# Altium project ARES_R30_Power.PrjPCB
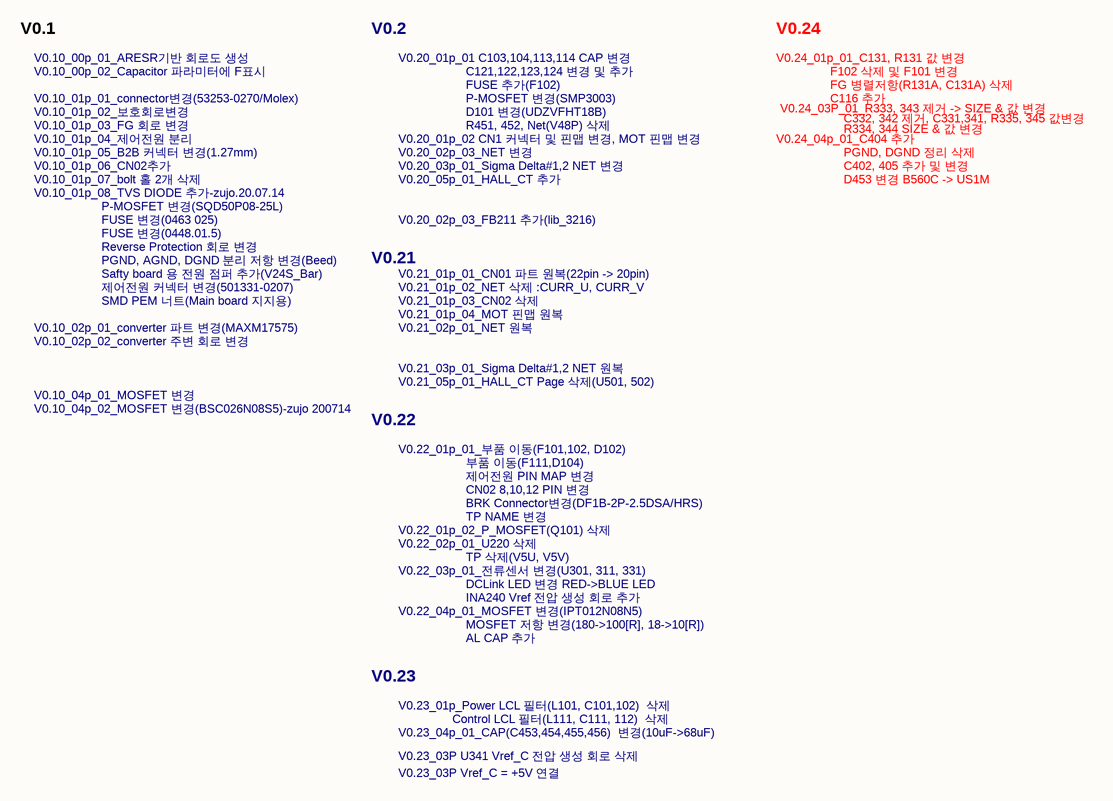
[diagram p0: 00.ChangeLog.SchDoc]
5 sheets, 177 parts. Net scope: global (net labels, ports and power ports of the same name join across sheets).
Board file: ARES_R30_Power.PcbDoc
Sheets:
  00.ChangeLog.SchDoc
  01.Connector.SchDoc
  02.DC-DCConverter.SchDoc
  03.Sensing.SchDoc
  04.MOSFET.SchDoc

## Sheet 00.ChangeLog.SchDoc: ARES_R30_Power
size A4; CompanyName: HIGEN; DrawnBy: 212084; Revision: V0.21; SheetNumber: 0; SheetTotal: 5; DrawingNumber: 임시도면

### Notes on the sheet
- V0.1
- V0.2
- V0.24
- V0.10_00p_01_ARESR기반 회로도 생성
- V0.10_00p_02_Capacitor 파라미터에 F표시
- V0.10_01p_01_connector변경(53253-0270/Molex)
- V0.10_01p_02_보호회로변경
- V0.20_01p_01 C103,104,113,114 CAP 변경
- C121,122,123,124 변경 및 추가
- FUSE 추가(F102)
- D101 변경(UDZVFHT18B)
- P-MOSFET 변경(SMP3003)
- V0.24_01p_01_C131, R131 값 변경
- V0.24_03P_01_R333, 343 제거 -> SIZE & 값 변경
- FG 병렬저항(R131A, C131A) 삭제
- F102 삭제 및 F101 변경
- C116 추가
- V0.10_01p_03_FG 회로 변경
- V0.10_01p_04_제어전원 분리
- V0.10_01p_05_B2B 커넥터 변경(1.27mm)
- V0.10_01p_06_CN02추가
- V0.10_01p_07_bolt 홀 2개 삭제
- V0.20_05p_01_HALL_CT 추가
- V0.20_02p_03_NET 변경
- V0.20_03p_01_Sigma Delta#1,2 NET 변경
- V0.20_01p_02 CN1 커넥터 및 핀맵 변경, MOT 핀맵 변경
- R451, 452, Net(V48P) 삭제
- V0.24_04p_01_C404 추가
- R334, 344 SIZE & 값 변경
- C332, 342 제거, C331,341, R335, 345 값변경
- PGND, DGND 정리 삭제
- C402, 405 추가 및 변경
- D453 변경 B560C -> US1M
- V0.10_01p_08_TVS DIODE 추가-zujo.20.07.14
- Reverse Protection 회로 변경
- FUSE 변경(0463 025)
- FUSE 변경(0448.01.5)
- P-MOSFET 변경(SQD50P08-25L)
- V0.20_02p_03_FB211 추가(lib_3216)
- PGND, AGND, DGND 분리 저항 변경(Beed)
- Safty board 용 전원 점퍼 추가(V24S_Bar)
- 제어전원 커넥터 변경(501331-0207)
- SMD PEM 너트(Main board 지지용)
- V0.21
- V0.21_01p_01_CN01 파트 원복(22pin -> 20pin)
- V0.21_01p_03_CN02 삭제
- V0.21_01p_02_NET 삭제 :CURR_U, CURR_V
- V0.21_01p_04_MOT 핀맵 원복
- V0.10_02p_01_converter 파트 변경(MAXM17575)
- V0.10_02p_02_converter 주변 회로 변경
- V0.21_05p_01_HALL_CT Page 삭제(U501, 502)
- V0.21_03p_01_Sigma Delta#1,2 NET 원복
- V0.21_02p_01_NET 원복
- V0.10_04p_01_MOSFET 변경
- V0.10_04p_02_MOSFET 변경(BSC026N08S5)-zujo 200714
- V0.22
- V0.22_01p_01_부품 이동(F101,102, D102)
- CN02 8,10,12 PIN 변경
- 제어전원 PIN MAP 변경
- 부품 이동(F111,D104)
- BRK Connector변경(DF1B-2P-2.5DSA/HRS)
- TP NAME 변경
- V0.22_02p_01_U220 삭제
- V0.22_03p_01_전류센서 변경(U301, 311, 331)
- V0.22_01p_02_P_MOSFET(Q101) 삭제
- TP 삭제(V5U, V5V)
- DCLink LED 변경 RED->BLUE LED
- V0.22_04p_01_MOSFET 변경(IPT012N08N5)
- INA240 Vref 전압 생성 회로 추가
- MOSFET 저항 변경(180->100[R], 18->10[R])
- AL CAP 추가
- V0.23
- V0.23_01p_Power LCL 필터(L101, C101,102)  삭제
- Control LCL 필터(L111, C111, 112)  삭제
- V0.23_04p_01_CAP(C453,454,455,456)  변경(10uF->68uF)
- V0.23_03P U341 Vref_C 전압 생성 회로 삭제
- V0.23_03P Vref_C = +5V 연결
- -
- DWG.
- UNIT
- DESIGNED
- mm
- CHECKED
- SCALE
- APPROVED
- N/S
- TITLE
- HIGEN
- Related DWG. No.
- SUBJECT
- DWG. No.
- Ver.

## Sheet 01.Connector.SchDoc: ARES_R30_Power
size A4; CompanyName: HIGEN; DrawnBy: 212084; Revision: V0.21; SheetNumber: 1; SheetTotal: 5; DrawingNumber: 임시도면
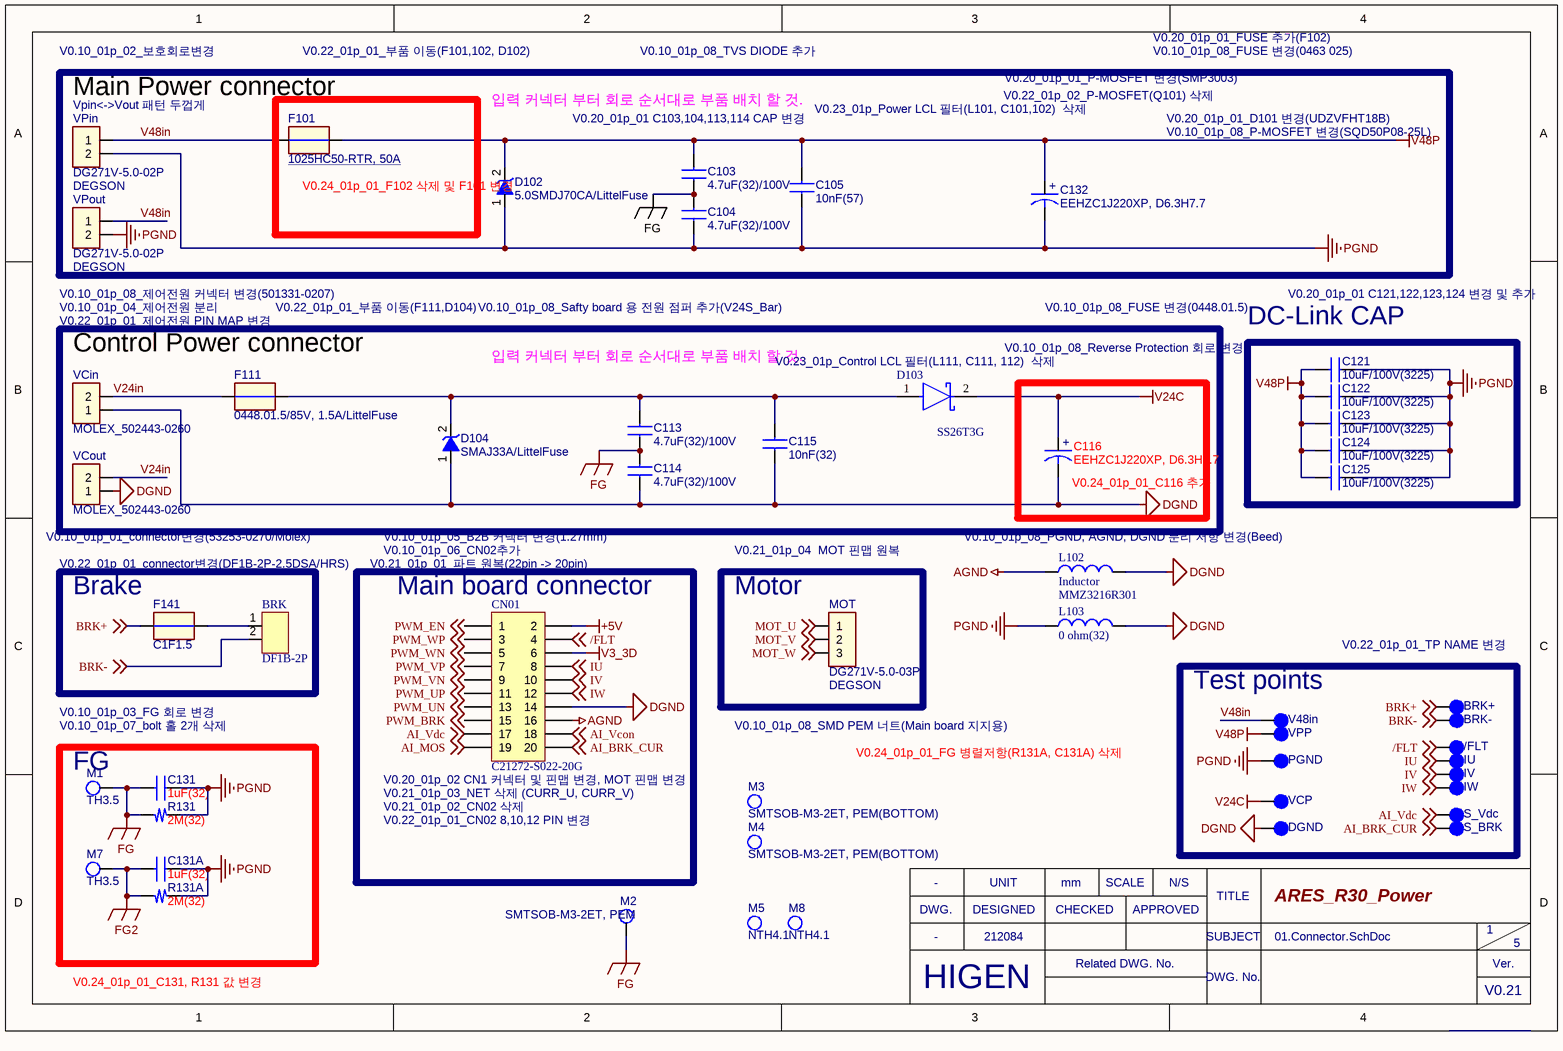
[diagram p1: 01.Connector.SchDoc]

### Parts
/FLT  TP  [TP-SMD]  (value not drawn)
BRK  DF1B-2P  [DF1B-2P-2.5DSA]
BRK+  TP  [TP-SMD]  (value not drawn)
BRK-  TP  [TP-SMD]  (value not drawn)
C103  4.7uF(32)/100V  [C-3216]
C104  4.7uF(32)/100V  [C-3216]
C105  10nF(57)  [C-5750]
C113  4.7uF(32)/100V  [C-3216]
C114  4.7uF(32)/100V  [C-3216]
C115  10nF(32)  [C-3216S]
C116  EEHZC1J220XP, D6.3H7.7  [EC-F80]
C121  10uF/100V(3225)  [C-3225]
C122  10uF/100V(3225)  [C-3225]
C123  10uF/100V(3225)  [C-3225]
C124  10uF/100V(3225)  [C-3225]
C125  10uF/100V(3225)  [C-3225]
C131  1uF(32)  [C-3216S]
C131A  1uF(32)  [C-3216S]
C132  EEHZC1J220XP, D6.3H7.7  [EC-F80]
CN01  C21272-S022-20G  [PH08SMD-D20P_PWR]
D102  5.0SMDJ70CA/LittelFuse  [DO-214AB]
D103  SS26T3G  [DO-214AA]  (value not drawn)
D104  SMAJ33A/LittelFuse  [SMA]
DGND  TP  [TP-SMD]  (value not drawn)
F101  1025HC50-RTR, 50A  [FUSE-SMT_1025HC50-RTR_50A]
F111  0448.01.5/85V, 1.5A/LittelFuse  [0448.005]
F141  C1F1.5  [C-3216]
IU  TP  [TP-SMD]  (value not drawn)
IV  TP  [TP-SMD]  (value not drawn)
IW  TP  [TP-SMD]  (value not drawn)
L102  Inductor  value MMZ3216R301  [L-3216]
L103  0 ohm(32)  [L-3216]
M1  TH3.5  [MH-3.5MM]
M2  SMTSOB-M3-2ET, PEM  [SMTSOB-M3-2]
M3  SMTSOB-M3-2ET, PEM(BOTTOM)  [SMTSOB-M3-2_BOT]
M4  SMTSOB-M3-2ET, PEM(BOTTOM)  [SMTSOB-M3-2_BOT]
M5  NTH4.1  [NTH4.1]
M7  TH3.5  [MH-3.5MM]
M8  NTH4.1  [NTH4.1]
MOT  DG271V-5.0-03P  [DG271V-5.0-03P]
PGND  TP  [TP-SMD]  (value not drawn)
R131  2M(32)  [R-3216S]
R131A  2M(32)  [R-3216S]
S_BRK  TP  [TP-SMD]  (value not drawn)
S_Vdc  TP  [TP-SMD]  (value not drawn)
V48in  TP  [TP-SMD]  (value not drawn)
VCin  MOLEX_502443-0260  [MOLEX_502443-0260]
VCout  MOLEX_502443-0260  [MOLEX_502443-0260]
VCP  TP  [TP-SMD]  (value not drawn)
VPin  DG271V-5.0-02P  [DG271V-5.0-02P]
VPout  DG271V-5.0-02P  [DG271V-5.0-02P]
VPP  TP  [TP-SMD]  (value not drawn)

### Blocks framed on the sheet
Main Power connector: C103-C105 C132 D102 VPin VPout
V0.24_01p_01_F102 삭제 및 F101 변경: F101
Control Power connector: C113-C115 D103 D104 F111 VCin VCout
V0.24_01p_01_C116 추가: C116
Brake: BRK F141
Main board connector: CN01
Motor: MOT
Test points: /FLT BRK+ BRK- DGND IU IV IW PGND S_BRK S_Vdc V48in VCP VPP
FG: C131 C131A M1 M7 R131 R131A

### Nets
+5V: CN01.2
AGND: CN01.16 L102.1
DGND: C114.1 C115.1 C116.2 CN01.14 D104.1(A) DGND.1 L102.2 L103.2 VCin.1 VCout.1
FG: C103.1 C104.2 C113.1 C114.2 C131.1 M1.1(TP) M2.1(TP) R131.1(P1)
FG2: C131A.1 M7.1(TP) R131A.1(P1)
PGND: C104.1 C105.1 C121.2 C122.2 C123.2 C124.2 C125.2 C131.2 C131A.2 C132.2 D102.1(A) L103.1 PGND.1 R131.2(P2) R131A.2(P2) VPin.2 VPout.2
V3_3D: CN01.6
V24C: C116.1 D103.2(C) VCP.1
V48P: C103.2 C105.2 C121.1 C122.1 C123.1 C124.1 C125.1 C132.1 D102.2(K) F101.2 VPP.1
/FLT: /FLT.1 CN01.4 ; off-sheet /FLT
AI_BRK_CUR: CN01.20 S_BRK.1 ; off-sheet AI_BRK_CUR
AI_MOS: CN01.19 ; off-sheet AI_MOS
AI_Vcon: CN01.18 ; off-sheet AI_Vcon
AI_Vdc: CN01.17 S_Vdc.1 ; off-sheet AI_Vdc
BRK+: BRK+.1 F141.2 ; off-sheet BRK+
BRK-: BRK.2 BRK-.1 ; off-sheet BRK-
IU: CN01.8 IU.1 ; off-sheet IU
IV: CN01.10 IV.1 ; off-sheet IV
IW: CN01.12 IW.1 ; off-sheet IW
MOT_U: MOT.1 ; off-sheet MOT_U
MOT_V: MOT.2 ; off-sheet MOT_V
MOT_W: MOT.3 ; off-sheet MOT_W
PWM_BRK: CN01.15 ; off-sheet PWM_BRK
PWM_EN: CN01.1 ; off-sheet PWM_EN
PWM_UN: CN01.13 ; off-sheet PWM_UN
PWM_UP: CN01.11 ; off-sheet PWM_UP
PWM_VN: CN01.9 ; off-sheet PWM_VN
PWM_VP: CN01.7 ; off-sheet PWM_VP
PWM_WN: CN01.5 ; off-sheet PWM_WN
PWM_WP: CN01.3 ; off-sheet PWM_WP
V24in: F111.1 VCin.2 VCout.2
V48in: F101.1 V48in.1 VPin.1 VPout.1
NetBRK_1: BRK.1 F141.1
NetC113_2: C113.2 C115.2 D103.1(A) D104.2(K) F111.2

Not connected (* = marked no-connect by the designer): M3 1(TP); M4 1(TP); M5 1(TP); M8 1(TP)

### Notes on the sheet
- V0.20_01p_01_FUSE 추가(F102)
- V0.10_01p_02_보호회로변경
- (near VPin) Vpin<->Vout 패턴 두껍게
- V0.22_01p_01_부품 이동(F101,102, D102)
- 입력 커넥터 부터 회로 순서대로 부품 배치 할 것.
- V0.10_01p_08_TVS DIODE 추가
- V0.23_01p_Power LCL 필터(L101, C101,102)  삭제
- V0.22_01p_02_P-MOSFET(Q101) 삭제
- V0.20_01p_01_P-MOSFET 변경(SMP3003)
- V0.10_01p_08_FUSE 변경(0463 025)
- V0.20_01p_01 C103,104,113,114 CAP 변경
- V0.10_01p_08_P-MOSFET 변경(SQD50P08-25L)
- V0.20_01p_01_D101 변경(UDZVFHT18B)
- DEGSON
- V0.10_01p_04_제어전원 분리
- V0.10_01p_08_제어전원 커넥터 변경(501331-0207)
- (near VPout) DEGSON
- V0.22_01p_01_부품 이동(F111,D104)
- V0.10_01p_08_Safty board 용 전원 점퍼 추가(V24S_Bar)
- V0.10_01p_08_FUSE 변경(0448.01.5)
- (near C121) DC-Link CAP
- V0.20_01p_01 C121,122,123,124 변경 및 추가
- V0.22_01p_01_제어전원 PIN MAP 변경
- (near D103) V0.23_01p_Control LCL 필터(L111, C111, 112)  삭제
- V0.10_01p_08_Reverse Protection 회로 변경
- (near VCout) V0.10_01p_01_connector변경(53253-0270/Molex)
- V0.22_01p_01_connector변경(DF1B-2P-2.5DSA/HRS)
- V0.21_01p_01_파트 원복(22pin -> 20pin)
- V0.10_01p_05_B2B 커넥터 변경(1.27mm)
- V0.10_01p_06_CN02추가
- V0.21_01p_04  MOT 핀맵 원복
- (near L102) V0.10_01p_08_PGND, AGND, DGND 분리 저항 변경(Beed)
- V0.22_01p_01_TP NAME 변경
- V0.10_01p_03_FG 회로 변경
- (near MOT) DEGSON
- V0.10_01p_07_bolt 홀 2개 삭제
- (near CN01) V0.20_01p_02 CN1 커넥터 및 핀맵 변경, MOT 핀맵 변경
- V0.10_01p_08_SMD PEM 너트(Main board 지지용)
- V0.24_01p_01_FG 병렬저항(R131A, C131A) 삭제
- (near CN01) V0.21_01p_03_NET 삭제 (CURR_U, CURR_V)
- V0.21_01p_02_CN02 삭제
- V0.22_01p_01_CN02 8,10,12 PIN 변경
- V0.24_01p_01_C131, R131 값 변경
- -
- DWG.
- UNIT
- DESIGNED
- mm
- CHECKED
- SCALE
- APPROVED
- N/S
- TITLE
- HIGEN
- Related DWG. No.
- SUBJECT
- DWG. No.
- Ver.
- (in symbol CAP_Pol) +

### Library data of the parts
/FLT BRK+ BRK- DGND IU IV IW PGND S_BRK S_Vdc V48in VCP VPP = 2H_TestPointThroughHole
BRK = Component_1
C103-C105 C113-C115 C121-C125 C131 C131A = CAP_NP
C116 C132 = CAP_Pol
CN01 = Header 10X2: Header, 10-Pin, Dual row; LatestRevisionDate: 17-Jul-2002; LatestRevisionNote: Re-released for DXP Platform.; Publisher: Altium Limited
D102 D104 = Diode_TVS
D103 = SS26T3G: DIODE SCHOTTKY 60V 2A SMB; 3DS Part Number: 417-00001; Manufacturer: ON Semi; Capacitance: SKIP; Library Path1: parts/Diode_ON_Semi_SS26T3G_eec.SchLib; Max Junction Temp: +150°C; Max Surge Forward Current: 40A; Peak Reverse Current: 0.2mA; Standoff Height: 0.05mm; Value: SKIP; Verification Version: 0.0.0.1; Part Number: SS26T3G; Datasheet Path: datasheets/Diode_ON_Semi_SS26T3G_eec.pdf; ComponentLink1Description: Upverter; ComponentLink1URL: https://upverter.com/upn/revision/e2f486cca74213e5/; ComponentLink2Description: Datasheet; ComponentLink2URL: http://www.onsemi.cn/PowerSolutions/document/SS26-D.PDF; Datasheet Path1: datasheets/Diode_ON_Semi_SS26T3G_eec.pdf; Dc Blocking Voltage: 60V; Digikey Description: DIODE SCHOTTKY 60V 2A SMB; Digikey Part Number: SS26T3GOSCT-ND; Footprint Url: http://www.onsemi.com/pub/Collateral/403A-03.PDF; Forward Current: 2A; Height: 2.47mm; Inductance: SKIP; Lead Free: yes; Library Ref1: SS26T3G; Max Repetitive Reverse Voltage: 60V; Mouser Description: SMB Power Surface Mount Package employing the Schottky Barrier principle in a metal-to-silicon power rectifier.; Mouser Part Number: 863-SS26T3G; Package: 403A-03; Price: 0.196415605484; Resistance: SKIP; RoHS: TRUE; Supplier 1: Digi-Key; Supplier 2: Mouser; Supplier Part Number 1: SS26T3GOSCT-ND; Supplier Part Number 2: 863-SS26T3G; Temperature: -55°C to +150°C; Temperature Range High: +150°C; Temperature Range Low: -55°C; Voltage: SKIP; Working Reverse Voltage: 60V; helpURL: https://upverter.com/upn/revision/e2f486cca74213e5/
F101 F111 F141 = Fuse
L102 L103 = Inductor: Code_IEC: 1005; Published: 8-Jun-2000; LatestRevisionDate: 29-May-2009; LatestRevisionNote: IPC-7351 Footprint Added.; PackageReference: 0402-A; Publisher: Altium Limited; PackageDescription: Chip Inductor; Code_JEITA: 0402
M1-M5 M7 M8 = ThroughHole
MOT = Connector_1x3
R131 R131A = Res
VCin VCout VPin VPout = Connector_1x2

## Sheet 02.DC-DCConverter.SchDoc: ARES_R30_Power
size A4; CompanyName: HIGEN; DrawnBy: 212084; Revision: V0.21; SheetNumber: 2; SheetTotal: 5; DrawingNumber: 임시도면
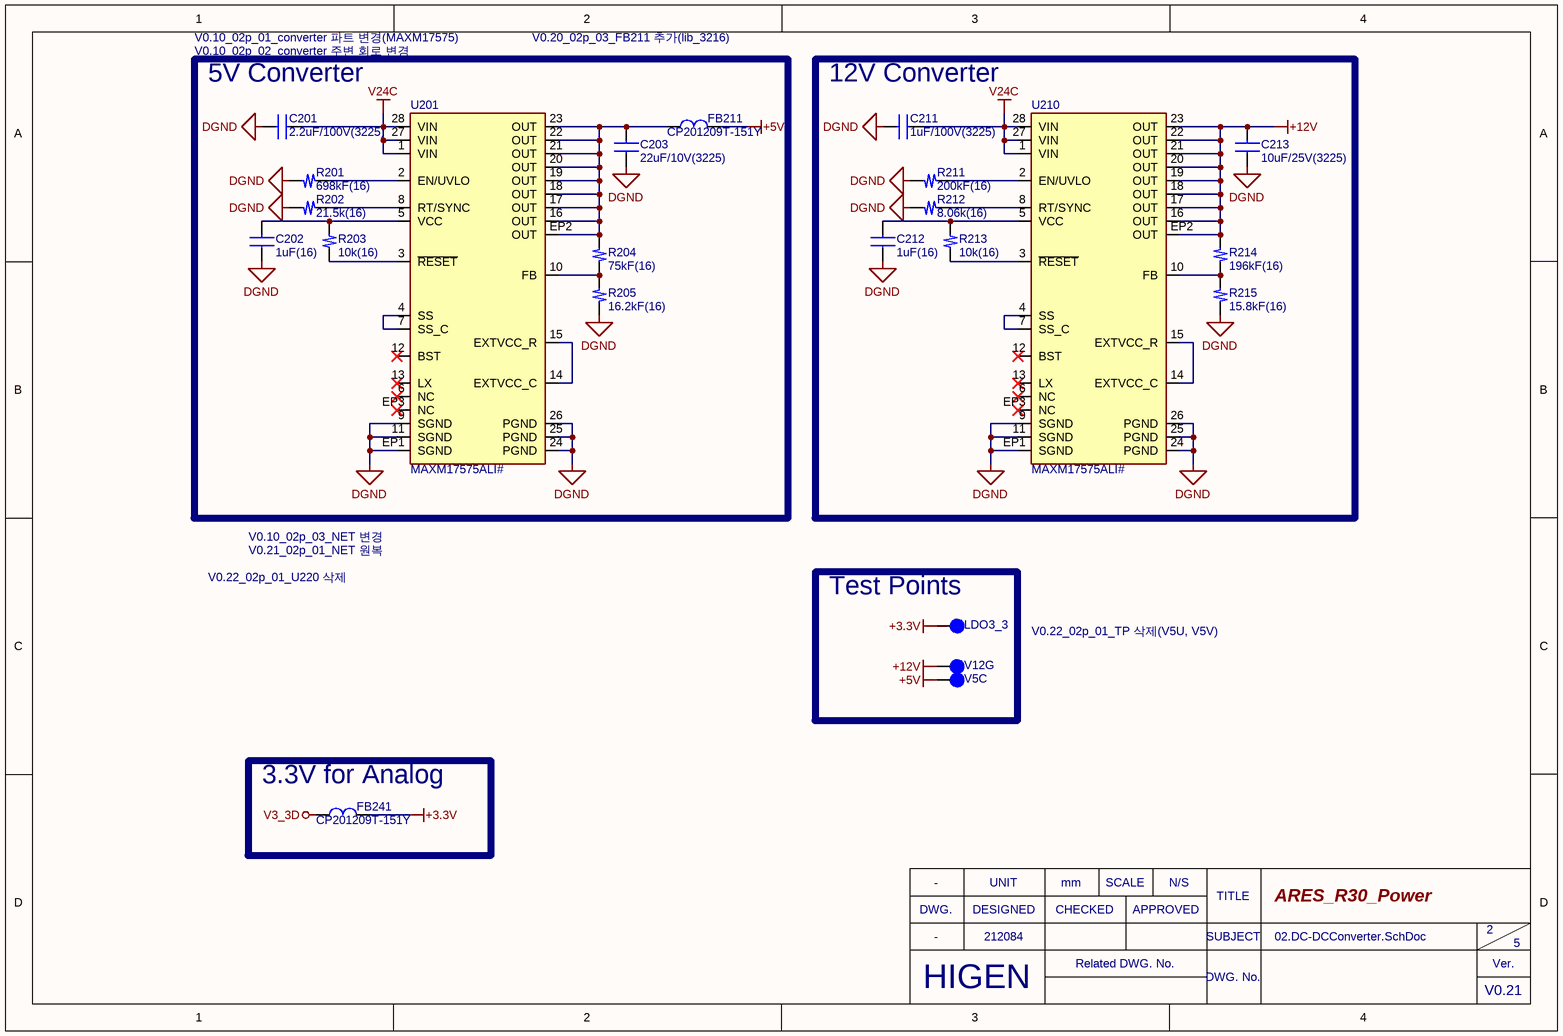
[diagram p2: 02.DC-DCConverter.SchDoc]

### Parts
C201  2.2uF/100V(3225)  [C-3225]
C202  1uF(16)  [C-1608S]
C203  22uF/10V(3225)  [C-3225]
C211  1uF/100V(3225)  [C-3225]
C212  1uF(16)  [C-1608S]
C213  10uF/25V(3225)  [C-3225]
FB211  CP201209T-151Y  [L-2012]
FB241  CP201209T-151Y  [L-2012]
LDO3_3  TP  [TP-SMD]  (value not drawn)
R201  698kF(16)  [R-1608S]
R202  21.5k(16)  [R-1608S]
R203  10k(16)  [R-1608S]
R204  75kF(16)  [R-1608S]
R205  16.2kF(16)  [R-1608S]
R211  200kF(16)  [R-1608S]
R212  8.06k(16)  [R-1608S]
R213  10k(16)  [R-1608S]
R214  196kF(16)  [R-1608S]
R215  15.8kF(16)  [R-1608S]
U201  MAXM17575ALI#  [LGA28-0.5MM-10X6.5_3.45]
U210  MAXM17575ALI#  [LGA28-0.5MM-10X6.5_3.45]
V5C  TP  [TP-SMD]  (value not drawn)
V12G  TP  [TP-SMD]  (value not drawn)

### Blocks framed on the sheet
5V Converter: C201-C203 FB211 R201-R205 U201
12V Converter: C211-C213 R211-R215 U210
Test Points: LDO3_3 V5C V12G
3.3V for Analog: FB241

### Nets
+3.3V: FB241.2 LDO3_3.1
+5V: FB211.2 V5C.1
+12V: C213.2 R214.1(P1) U210.16(OUT) U210.17(OUT) U210.18(OUT) U210.19(OUT) U210.20(OUT) U210.21(OUT) U210.22(OUT) U210.23(OUT) U210.EP2(OUT) V12G.1
DGND: C201.1 C202.2 C203.1 C211.1 C212.2 C213.1 R201.2(P2) R202.2(P2) R205.2(P2) R211.2(P2) R212.2(P2) R215.2(P2) U201.9(SGND) U201.11(SGND) U201.24(PGND) U201.25(PGND) U201.26(PGND) U201.EP1(SGND) U210.9(SGND) U210.11(SGND) U210.24(PGND) U210.25(PGND) U210.26(PGND) U210.EP1(SGND)
V3_3D: FB241.1
V24C: C201.2 C211.2 U201.1(VIN) U201.27(VIN) U201.28(VIN) U210.1(VIN) U210.27(VIN) U210.28(VIN)
NetC202_1: C202.1 R203.1(P1) U201.5(VCC)
NetC203_2: C203.2 FB211.1 R204.1(P1) U201.16(OUT) U201.17(OUT) U201.18(OUT) U201.19(OUT) U201.20(OUT) U201.21(OUT) U201.22(OUT) U201.23(OUT) U201.EP2(OUT)
NetC212_1: C212.1 R213.1(P1) U210.5(VCC)
NetR201_1: R201.1(P1) U201.2(EN/UVLO)
NetR202_1: R202.1(P1) U201.8(RT/SYNC)
NetR203_2: R203.2(P2) U201.3(~{RESET})
NetR204_2: R204.2(P2) R205.1(P1) U201.10(FB)
NetR211_1: R211.1(P1) U210.2(EN/UVLO)
NetR212_1: R212.1(P1) U210.8(RT/SYNC)
NetR213_2: R213.2(P2) U210.3(~{RESET})
NetR214_2: R214.2(P2) R215.1(P1) U210.10(FB)
NetU201_4: U201.4(SS) U201.7(SS_C)
NetU201_14: U201.14(EXTVCC_C) U201.15(EXTVCC_R)
NetU210_4: U210.4(SS) U210.7(SS_C)
NetU210_14: U210.14(EXTVCC_C) U210.15(EXTVCC_R)

Not connected (* = marked no-connect by the designer): U201 6(NC)* 12(BST)* 13(LX)* EP3(NC)*; U210 6(NC)* 12(BST)* 13(LX)* EP3(NC)*

### Notes on the sheet
- V0.10_02p_01_converter 파트 변경(MAXM17575)
- V0.20_02p_03_FB211 추가(lib_3216)
- V0.10_02p_02_converter 주변 회로 변경
- V0.22_02p_01_U220 삭제
- V0.10_02p_03_NET 변경
- V0.21_02p_01_NET 원복
- V0.22_02p_01_TP 삭제(V5U, V5V)
- -
- DWG.
- UNIT
- DESIGNED
- mm
- CHECKED
- SCALE
- APPROVED
- N/S
- TITLE
- HIGEN
- Related DWG. No.
- SUBJECT
- DWG. No.
- Ver.

### Library data of the parts
C201-C203 C211-C213 = CAP_NP
FB211 FB241 = FBead
LDO3_3 V5C V12G = 2H_TestPointThroughHole: Mfr: Keystone Electronics; MfrNum: 5002; TIIntPartnumber: 2H0026; DescriptiveText: Testpoint Miniature Through Hole; Vendor: Digikey; Cost100: 0.163; Cost10K: 0.10; PartName: TestPointThroughHole
R201-R205 R211-R215 = Res

## Sheet 03.Sensing.SchDoc: ARES_R30_Power
size A4; CompanyName: HIGEN; DrawnBy: 212084; Revision: V0.21; SheetNumber: 3; SheetTotal: 5; DrawingNumber: 임시도면
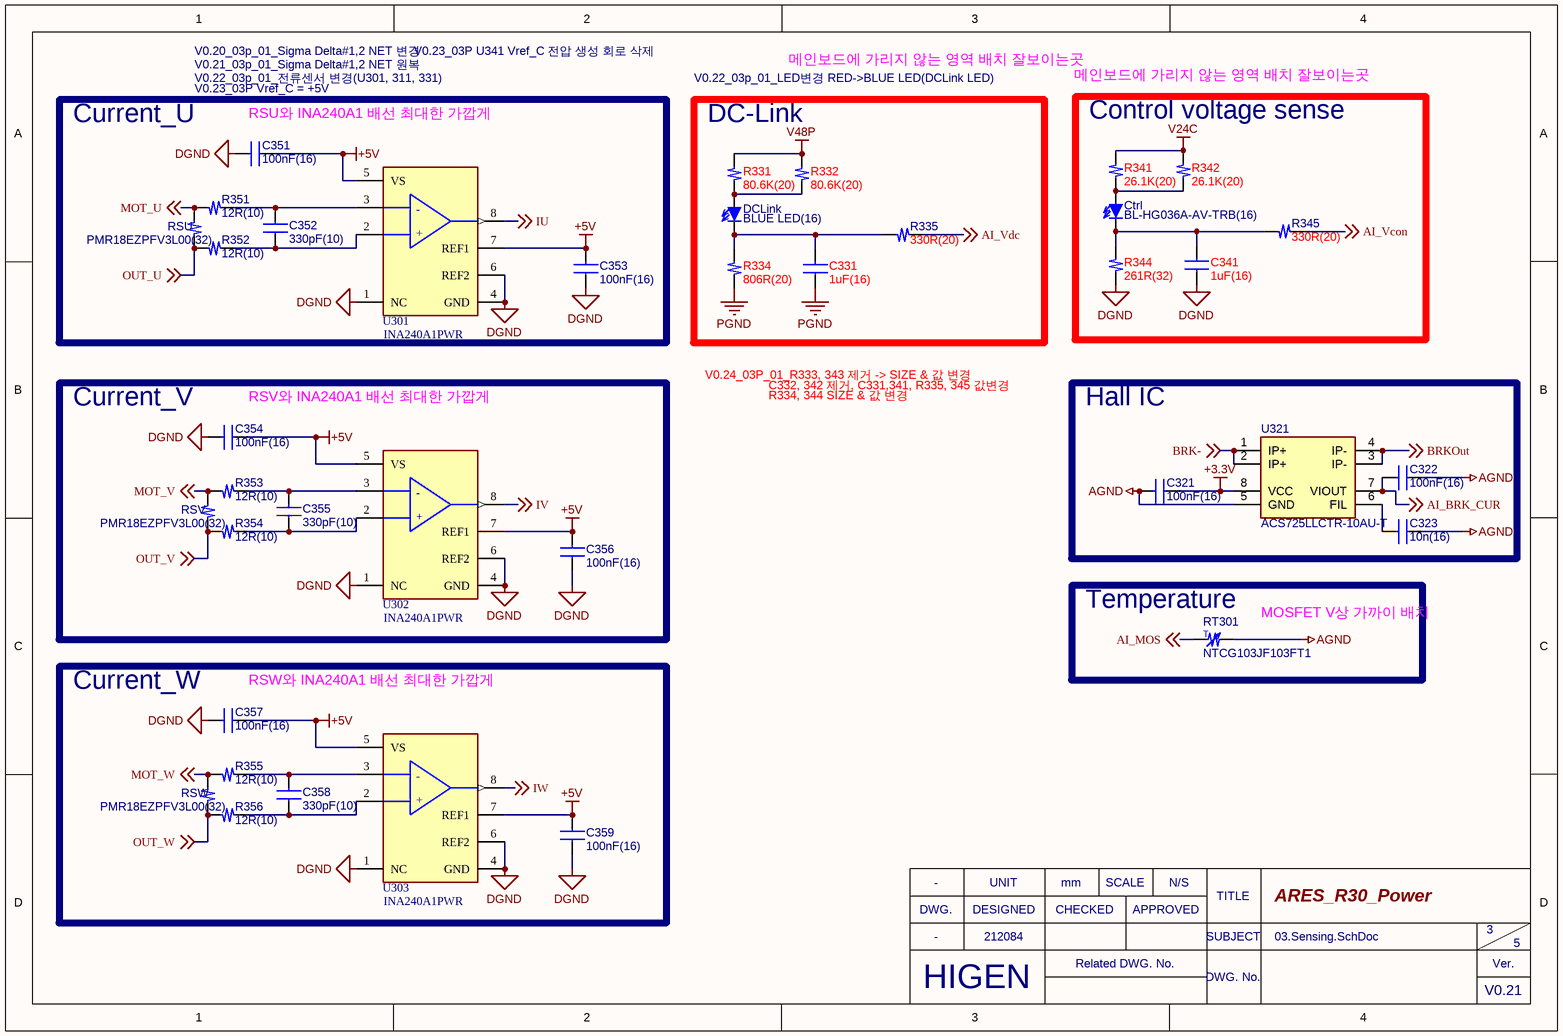
[diagram p3: 03.Sensing.SchDoc]

### Parts
C321  100nF(16)  [C-1608S]
C322  100nF(16)  [C-1608S]
C323  10n(16)  [C-1608S]
C331  1uF(16)  [C-1608S]
C341  1uF(16)  [C-1608S]
C351  100nF(16)  [C-1608S]
C352  330pF(10)  [C-1005S]
C353  100nF(16)  [C-1608]
C354  100nF(16)  [C-1608S]
C355  330pF(10)  [C-1005S]
C356  100nF(16)  [C-1608]
C357  100nF(16)  [C-1608S]
C358  330pF(10)  [C-1005S]
C359  100nF(16)  [C-1608]
Ctrl  BL-HG036A-AV-TRB(16)  [LED-1608-G]
DCLink  BLUE LED(16)  [LED-1608-B]
R331  80.6K(20)  [RES-2012]
R332  80.6K(20)  [RES-2012]
R334  806R(20)  [RES-2012]
R335  330R(20)  [RES-2012]
R341  26.1K(20)  [RES-2012]
R342  26.1K(20)  [RES-2012]
R344  261R(32)  [R-3216S]
R345  330R(20)  [RES-2012]
R351  12R(10)  [R-1005S]
R352  12R(10)  [R-1005S]
R353  12R(10)  [R-1005S]
R354  12R(10)  [R-1005S]
R355  12R(10)  [R-1005S]
R356  12R(10)  [R-1005S]
RSU  PMR18EZPFV3L00(32)  [R-5025]
RSV  PMR18EZPFV3L00(32)  [R-5025]
RSW  PMR18EZPFV3L00(32)  [R-5025]
RT301  NTCG103JF103FT1  [L-1005]
U301  INA240A1PWR  [TSSOP-8]
U302  INA240A1PWR  [TSSOP-8]
U303  INA240A1PWR  [TSSOP-8]
U321  ACS725LLCTR-10AU-T  [SO-8]

### Blocks framed on the sheet
Current_U: C351-C353 R351 R352 RSU U301
DC-Link: C331 DCLink R331 R332 R334 R335
Control voltage sense: C341 Ctrl R341 R342 R344 R345
Current_V: C354-C356 R353 R354 RSV U302
Hall IC: C321-C323 U321
Temperature: RT301
Current_W: C357-C359 R355 R356 RSW U303

### Nets
+3.3V: C321.2 U321.8(VCC)
+5V: C351.1 C353.1 C354.1 C356.1 C357.1 C359.1 U301.5(VS) U301.7(REF1) U302.5(VS) U302.7(REF1) U303.5(VS) U303.7(REF1)
AGND: C321.1 C322.2 C323.2 RT301.1 U321.5(GND)
DGND: C341.2 C351.2 C353.2 C354.2 C356.2 C357.2 C359.2 R344.2(P2) U301.1(NC) U301.4(GND) U301.6(REF2) U302.1(NC) U302.4(GND) U302.6(REF2) U303.1(NC) U303.4(GND) U303.6(REF2)
PGND: C331.2 R334.2(P2)
V24C: R341.1(P1) R342.1(P1)
V48P: R331.1(P1) R332.1(P1)
AI_BRK_CUR: C322.1 U321.7(VIOUT) ; off-sheet AI_BRK_CUR
AI_MOS: RT301.2 ; off-sheet AI_MOS
AI_Vcon: R345.2(P2) ; off-sheet AI_Vcon
AI_Vdc: R335.2(P2) ; off-sheet AI_Vdc
BRK-: U321.1(IP+) U321.2(IP+) ; off-sheet BRK-
BRKOut: U321.3(IP-) U321.4(IP-) ; off-sheet BRKOut
IU: U301.8(OUT) ; off-sheet IU
IV: U302.8(OUT) ; off-sheet IV
IW: U303.8(OUT) ; off-sheet IW
MOT_U: R351.1(P1) RSU.1(P1) ; off-sheet MOT_U
MOT_V: R353.1(P1) RSV.1(P1) ; off-sheet MOT_V
MOT_W: R355.1(P1) RSW.1(P1) ; off-sheet MOT_W
OUT_U: R352.1(P1) RSU.2(P2) ; off-sheet OUT_U  [project net PH_U]
OUT_V: R354.1(P1) RSV.2(P2) ; off-sheet OUT_V  [project net PH_V]
OUT_W: R356.1(P1) RSW.2(P2) ; off-sheet OUT_W  [project net PH_W]
NetC323_1: C323.1 U321.6(FIL)
NetC331_1: C331.1 DCLink.2(Cathode) R334.1(P1) R335.1(P1)
NetC341_1: C341.1 Ctrl.2(Cathode) R344.1(P1) R345.1(P1)
NetC352_1: C352.1 R352.2(P2) U301.2(IN+)
NetC352_2: C352.2 R351.2(P2) U301.3(IN-)
NetC355_1: C355.1 R354.2(P2) U302.2(IN+)
NetC355_2: C355.2 R353.2(P2) U302.3(IN-)
NetC358_1: C358.1 R356.2(P2) U303.2(IN+)
NetC358_2: C358.2 R355.2(P2) U303.3(IN-)
NetCtrl_1: Ctrl.1(Anode) R341.2(P2) R342.2(P2)
NetDCLink_1: DCLink.1(Anode) R331.2(P2) R332.2(P2)

### Notes on the sheet
- V0.20_03p_01_Sigma Delta#1,2 NET 변경
- V0.21_03p_01_Sigma Delta#1,2 NET 원복
- V0.22_03p_01_전류센서 변경(U301, 311, 331)
- V0.23_03P Vref_C = +5V
- (near C351) RSU와 INA240A1 배선 최대한 가깝게
- V0.23_03P U341 Vref_C 전압 생성 회로 삭제
- V0.22_03p_01_LED변경 RED->BLUE LED(DCLink LED)
- 메인보드에 가리지 않는 영역 배치 잘보이는곳
- V0.24_03P_01_R333, 343 제거 -> SIZE & 값 변경
- (near C354) RSV와 INA240A1 배선 최대한 가깝게
- R334, 344 SIZE & 값 변경
- C332, 342 제거, C331,341, R335, 345 값변경
- (near RT301) MOSFET V상 가까이 배치
- (near C357) RSW와 INA240A1 배선 최대한 가깝게
- -
- DWG.
- UNIT
- DESIGNED
- mm
- CHECKED
- SCALE
- APPROVED
- N/S
- TITLE
- HIGEN
- Related DWG. No.
- SUBJECT
- DWG. No.
- Ver.
- (in symbol INA240A1PWR) -; +
- (in symbol Res_Thermal) T

### Library data of the parts
C321-C323 C331 C341 C351-C359 = CAP_NP
Ctrl DCLink = LED
R331 R332 R334 R335 R341 R342 R344 R345 R351-R356 RSU RSV RSW = Res
RT301 = Res_Thermal
U301-U303 = INA240A1PWR: IC CURR SENSE 1 CIRCUIT 8TSSOP; Manufacturer: Texas Instruments; Bandwidth: 400kHz; Input Bias Current: 90uA; Input Offset Voltage: 0.005mV; Max Junction Temp: +150°C; Max Supply Voltage: 5.5V; Min Supply Voltage: 2.7V; Nominal Supply Current: 1.8mA; Number Of Channels: 1; Standoff Height: 0.05mm; Verification Version: 0.0.0.3; Voltage Gain: 0.02V/mV; Datasheet Path: datasheets/IC_Texas_Instruments_INA240A1PWR_eec.pdf; Ambient Temperature Range High: +125°C; Ambient Temperature Range Low: -40°C; Automotive: No; ComponentLink1Description: Upverter; ComponentLink1URL: https://upverter.com/part/id/d93607e109c824dd/; ComponentLink2Description: Datasheet; ComponentLink2URL: http://www.ti.com/lit/ds/symlink/ina240.pdf; Digikey Description: IC CURR SENSE 1 CIRCUIT 8TSSOP; Digikey Part Number: 296-45088-1-ND; Height: 1.2mm; Ipc Land Pattern Name: SOP65P300X120-8; Lead Free: Yes; Mouser Part Number: 595-INA240A1PWR; Package: PW0008A; Part Number: INA240A1PWR; RoHS: TRUE; Supplier 1: Digi-Key; Supplier 2: Mouser; Supplier Part Number 1: 296-45088-1-ND; Supplier Part Number 2: 595-INA240A1PWR; Temperature: -40°C to +125°C; Temperature Range High: +125°C; Temperature Range Low: -40°C; helpURL: https://upverter.com/part/id/d93607e109c824dd/
U321 = ACS725LLCTR

## Sheet 04.MOSFET.SchDoc: ARES_R30_Power
size A4; CompanyName: HIGEN; DrawnBy: 212084; Revision: V0.21; SheetNumber: 4; SheetTotal: 5; DrawingNumber: 임시도면
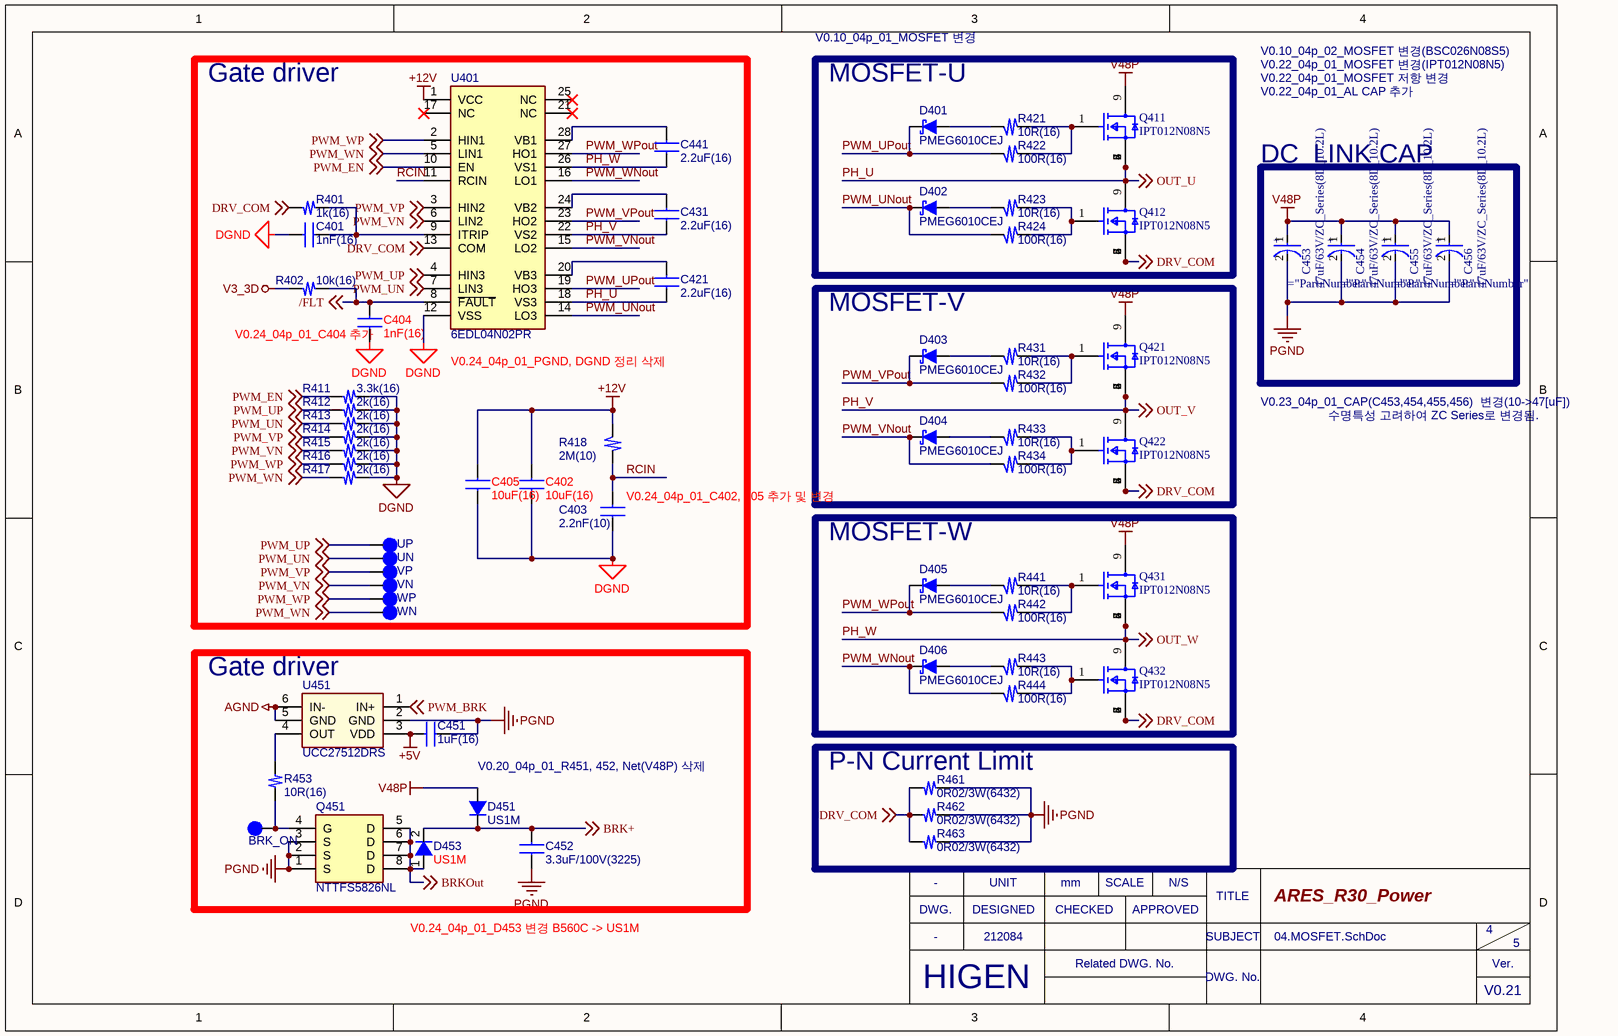
[diagram p4: 04.MOSFET.SchDoc]

### Parts
BRK_ON  TP  [TP-SMD]  (value not drawn)
C401  1nF(16)  [C-1608S]
C402  10uF(16)  [C-1608S]
C403  2.2nF(10)  [C-1005S]
C404  1nF(16)  [C-1608S]
C405  10uF(16)  [C-1608S]
C421  2.2uF(16)  [C-1608S]
C431  2.2uF(16)  [C-1608S]
C441  2.2uF(16)  [C-1608S]
C451  1uF(16)  [C-1608S]
C452  3.3uF/100V(3225)  [C-3225]
C453  47uF/63V/ZC_Series(8D_10.2L)  [EC-H10]
C454  47uF/63V/ZC_Series(8D_10.2L)  [EC-H10]
C455  47uF/63V/ZC_Series(8D_10.2L)  [EC-H10]
C456  47uF/63V/ZC_Series(8D_10.2L)  [EC-H10]
D401  PMEG6010CEJ  [SOD-323]
D402  PMEG6010CEJ  [SOD-323]
D403  PMEG6010CEJ  [SOD-323]
D404  PMEG6010CEJ  [SOD-323]
D405  PMEG6010CEJ  [SOD-323]
D406  PMEG6010CEJ  [SOD-323]
D451  US1M  [SMA]
D453  US1M  [SMA]
Q411  IPT012N08N5  [PG-HSOF-8-1]
Q412  IPT012N08N5  [PG-HSOF-8-1]
Q421  IPT012N08N5  [PG-HSOF-8-1]
Q422  IPT012N08N5  [PG-HSOF-8-1]
Q431  IPT012N08N5  [PG-HSOF-8-1]
Q432  IPT012N08N5  [PG-HSOF-8-1]
Q451  NTTFS5826NL  [WDFN-8]
R401  1k(16)  [R-1608S]
R402  10k(16)  [R-1608S]
R411  3.3k(16)  [R-1608S]
R412  2k(16)  [R-1608S]
R413  2k(16)  [R-1608S]
R414  2k(16)  [R-1608S]
R415  2k(16)  [R-1608S]
R416  2k(16)  [R-1608S]
R417  2k(16)  [R-1608S]
R418  2M(10)  [RES-1005S]
R421  10R(16)  [R-1608S]
R422  100R(16)  [R-1608S]
R423  10R(16)  [R-1608S]
R424  100R(16)  [R-1608S]
R431  10R(16)  [R-1608S]
R432  100R(16)  [R-1608S]
R433  10R(16)  [R-1608S]
R434  100R(16)  [R-1608S]
R441  10R(16)  [R-1608S]
R442  100R(16)  [R-1608S]
R443  10R(16)  [R-1608S]
R444  100R(16)  [R-1608S]
R453  10R(16)  [R-1608S]
R461  0R02/3W(6432)  [R-6432]
R462  0R02/3W(6432)  [R-6432]
R463  0R02/3W(6432)  [R-6432]
U401  6EDL04N02PR  [TSSOP-28]
U451  UCC27512DRS  [WSON-6]
UN  TP  [TP-SMD]  (value not drawn)
UP  TP  [TP-SMD]  (value not drawn)
VN  TP  [TP-SMD]  (value not drawn)
VP  TP  [TP-SMD]  (value not drawn)
WN  TP  [TP-SMD]  (value not drawn)
WP  TP  [TP-SMD]  (value not drawn)

### Blocks framed on the sheet
Gate driver: C401-C405 C421 C431 C441 R401 R402 R411-R418 U401 UN UP VN VP WN WP
MOSFET-U: D401 D402 Q411 Q412 R421-R424
DC_LINK CAP: C453-C456
MOSFET-V: D403 D404 Q421 Q422 R431-R434
MOSFET-W: D405 D406 Q431 Q432 R441-R444
Gate driver: BRK_ON C451 C452 D451 D453 Q451 R453 U451
P-N Current Limit: R461-R463

### Nets
+5V: C451.1 U451.3(VDD)
+12V: C402.1 C405.1 R418.2 U401.1(VCC)
AGND: U451.5(GND) U451.6(IN-)
DGND: C401.1 C402.2 C403.1 C404.1 C405.2 R411.2(P2) R412.1(P1) R413.1(P1) R414.1(P1) R415.1(P1) R416.2(P2) R417.2(P2) U401.12(VSS)
PGND: C451.2 C452.1 C453.2(A) C454.2(A) C455.2(A) C456.2(A) Q451.1(S) Q451.2(S) Q451.3(S) R461.1(P1) R462.1(P1) R463.1(P1) U451.2(GND)
V3_3D: R402.1(P1)
V48P: C453.1(C) C454.1(C) C455.1(C) C456.1(C) D451.1(A) Q411.9(Drain) Q421.9(Drain) Q431.9(Drain)
/FLT: C404.2 R402.2(P2) U401.8(~{FAULT}) ; off-sheet /FLT
BRK+: C452.2 D451.2(K) D453.2(K) ; off-sheet BRK+
BRKOut: D453.1(A) Q451.5(D) Q451.6(D) Q451.7(D) Q451.8(D) ; off-sheet BRKOut
DRV_COM: Q412.2(Source) Q412.3(Source) Q412.4(Source) Q412.5(Source) Q412.6(Source) Q412.7(Source) Q412.8(Source) Q422.2(Source) Q422.3(Source) Q422.4(Source) Q422.5(Source) Q422.6(Source) Q422.7(Source) Q422.8(Source) Q432.2(Source) Q432.3(Source) Q432.4(Source) Q432.5(Source) Q432.6(Source) Q432.7(Source) Q432.8(Source) R401.1(P1) R461.2(P2) R462.2(P2) R463.2(P2) U401.13(COM) ; off-sheet DRV_COM
PH_U: C421.2 Q411.2(Source) Q411.3(Source) Q411.4(Source) Q411.5(Source) Q411.6(Source) Q411.7(Source) Q411.8(Source) Q412.9(Drain) U401.18(VS3) ; off-sheet OUT_U  [also labelled OUT_U]
PH_V: C431.1 Q421.2(Source) Q421.3(Source) Q421.4(Source) Q421.5(Source) Q421.6(Source) Q421.7(Source) Q421.8(Source) Q422.9(Drain) U401.22(VS2) ; off-sheet OUT_V  [also labelled OUT_V]
PH_W: C441.1 Q431.2(Source) Q431.3(Source) Q431.4(Source) Q431.5(Source) Q431.6(Source) Q431.7(Source) Q431.8(Source) Q432.9(Drain) U401.26(VS1) ; off-sheet OUT_W  [also labelled OUT_W]
PWM_BRK: U451.1(IN+) ; off-sheet PWM_BRK
PWM_EN: R411.1(P1) U401.10(EN) ; off-sheet PWM_EN
PWM_UN: R413.2(P2) U401.7(LIN3) UN.1 ; off-sheet PWM_UN
PWM_UNout: D402.2(K) R424.2 U401.14(LO3)
PWM_UP: R412.2(P2) U401.4(HIN3) UP.1 ; off-sheet PWM_UP
PWM_UPout: D401.2(K) R422.2 U401.19(HO3)
PWM_VN: R415.2(P2) U401.6(LIN2) VN.1 ; off-sheet PWM_VN
PWM_VNout: D404.2(K) R434.2 U401.15(LO2)
PWM_VP: R414.2(P2) U401.3(HIN2) VP.1 ; off-sheet PWM_VP
PWM_VPout: D403.2(K) R432.2 U401.23(HO2)
PWM_WN: R417.1(P1) U401.5(LIN1) WN.1 ; off-sheet PWM_WN
PWM_WNout: D406.2(K) R444.2 U401.16(LO1)
PWM_WP: R416.1(P1) U401.2(HIN1) WP.1 ; off-sheet PWM_WP
PWM_WPout: D405.2(K) R442.2 U401.27(HO1)
RCIN: C403.2 R418.1 U401.11(RCIN)
NetBRK_ON_1: BRK_ON.1 Q451.4(G) R453.1(P1)
NetC401_2: C401.2 R401.2(P2) U401.9(ITRIP)
NetC421_1: C421.1 U401.20(VB3)
NetC431_2: C431.2 U401.24(VB2)
NetC441_2: C441.2 U401.28(VB1)
NetD401_1: D401.1(A) R421.2
NetD402_1: D402.1(A) R423.2
NetD403_1: D403.1(A) R431.2
NetD404_1: D404.1(A) R433.2
NetD405_1: D405.1(A) R441.2
NetD406_1: D406.1(A) R443.2
NetQ411_1: Q411.1(Gate) R421.1 R422.1
NetQ412_1: Q412.1(Gate) R423.1 R424.1
NetQ421_1: Q421.1(Gate) R431.1 R432.1
NetQ422_1: Q422.1(Gate) R433.1 R434.1
NetQ431_1: Q431.1(Gate) R441.1 R442.1
NetQ432_1: Q432.1(Gate) R443.1 R444.1
NetR453_2: R453.2(P2) U451.4(OUT)

Not connected (* = marked no-connect by the designer): U401 17(NC)* 21(NC)* 25(NC)*

### Notes on the sheet
- V0.10_04p_01_MOSFET 변경
- V0.10_04p_02_MOSFET 변경(BSC026N08S5)
- V0.22_04p_01_MOSFET 변경(IPT012N08N5)
- V0.22_04p_01_MOSFET 저항 변경
- V0.22_04p_01_AL CAP 추가
- (near C404) V0.24_04p_01_C404 추가
- (near U401) V0.24_04p_01_PGND, DGND 정리 삭제
- V0.23_04p_01_CAP(C453,454,455,456)  변경(10->47[uF])
- 수명특성 고려하여 ZC Series로 변경됨.
- (near C403) V0.24_04p_01_C402, 405 추가 및 변경
- (near D451) V0.20_04p_01_R451, 452, Net(V48P) 삭제
- V0.24_04p_01_D453 변경 B560C -> US1M
- -
- DWG.
- UNIT
- DESIGNED
- mm
- CHECKED
- SCALE
- APPROVED
- N/S
- TITLE
- HIGEN
- Related DWG. No.
- SUBJECT
- DWG. No.
- Ver.
- (in symbol EEE-FK1J680UP) +

### Library data of the parts
BRK_ON UN UP VN VP WN WP = 2H_TestPointThroughHole: as LDO3_3 on sheet 02.DC-DCConverter; PartName: TestPointThroughHole
C401-C405 C421 C431 C441 C452 = CAP_NP
C451 = Cap_NP
C453-C456 = EEE-FK1J680UP
D401-D406 = Diode_schottky
D451 D453 = Diode
Q411 Q412 Q421 Q422 Q431 Q432 = IAUT300N08S5N012ATMA2: TRANS 80V 300A 1.2MOHM TOLL; Manufacturer: Infineon; Automotive Grade: Grade 0; Depletion Mode: False; Drain To Source Resistance: 1mΩ; Gate Charge At Vgs: 178nC @ 10V; Gate To Source Voltage: 20V; Input Capacitace At Vds: 12500pF @ 40V; Max Forward Diode Voltage: 1.2V; Max Junction Temp: +175°C; Number Of Channels: 1; Power Dissipation: 375W; Pulse Drain Current: 1200A; Reverse Recovery Charge: 177nC; Reverse Recovery Time: 86ns; Threshold Vgs Max: 3.8V; Threshold Vgs Min: 2.2V; Turn Off Delay Time: 69ns; Turn On Delay Time: 31ns; Typ Forward Diode Voltage: 0.9V; Verification Version: 0.0.0.3; Datasheet Path: datasheets/Trans_Infineon_IAUT300N08S5N012ATMA2_eec.pdf; Automotive: Yes; ComponentLink1Description: Upverter; ComponentLink1URL: https://upverter.com/part/id/5247eac4253ea04b/; ComponentLink2Description: Datasheet; ComponentLink2URL: https://www.infineon.com/dgdl/Infineon-IAUT300N08S5N012-DS-v01_00-EN.pdf?fileId=5546d46258fc0bc10158fdabe0f90580; Continuous Drain Current: 300A; Digikey Description: TRANS 80V 300A 1.2MOHM TOLL; Digikey Part Number: IAUT300N08S5N012ATMA2CT-ND; Drain To Source Breakdown Voltage: 80V; Drain To Source Voltage: 80V; Footprint Url: https://www.infineon.com/cms/en/product/packages/PG-HSOF/PG-HSOF-8-1/; Height: 2.4mm; Lead Free: Yes; Mouser Description: Trans MOSFET N-CH 80V 300A Automotive 9-Pin(8+Tab) HSOF T/R; Mouser Part Number: 726-IAUT300N08S5N012; Number Of N Channels: 1; Package: PG-HSOF-8; Part Number: IAUT300N08S5N012ATMA2; RoHS: TRUE; Supplier 1: Digi-Key; Supplier 2: Mouser; Supplier Part Number 1: IAUT300N08S5N012ATMA2CT-ND; Supplier Part Number 2: 726-IAUT300N08S5N012; Temperature: -55°C to +175°C; Temperature Range High: +175°C; Temperature Range Low: -55°C; helpURL: https://upverter.com/part/id/5247eac4253ea04b/
R401 R402 R411-R418 R421-R424 R431-R434 R441-R444 R453 R461-R463 = Res

## Nets that join several sheets
+3.3V: 02.DC-DCConverter (FB241.2 LDO3_3.1), 03.Sensing (C321.2 U321.8)
+5V: 01.Connector (CN01.2), 02.DC-DCConverter (FB211.2 V5C.1), 03.Sensing (12 pins), 04.MOSFET (C451.1 U451.3)
+12V: 02.DC-DCConverter (12 pins), 04.MOSFET (C402.1 C405.1 R418.2 U401.1)
AGND: 01.Connector (CN01.16 L102.1), 03.Sensing (5 pins), 04.MOSFET (U451.5 U451.6)
DGND: 01.Connector (10 pins), 02.DC-DCConverter (24 pins), 03.Sensing (17 pins), 04.MOSFET (13 pins)
PGND: 01.Connector (17 pins), 03.Sensing (C331.2 R334.2), 04.MOSFET (13 pins)
V3_3D: 01.Connector (CN01.6), 02.DC-DCConverter (FB241.1), 04.MOSFET (R402.1)
V24C: 01.Connector (C116.1 D103.2 VCP.1), 02.DC-DCConverter (8 pins), 03.Sensing (R341.1 R342.1)
V48P: 01.Connector (11 pins), 03.Sensing (R331.1 R332.1), 04.MOSFET (8 pins)
/FLT: 01.Connector (/FLT.1 CN01.4), 04.MOSFET (C404.2 R402.2 U401.8)
AI_BRK_CUR: 01.Connector (CN01.20 S_BRK.1), 03.Sensing (C322.1 U321.7)
AI_MOS: 01.Connector (CN01.19), 03.Sensing (RT301.2)
AI_Vcon: 01.Connector (CN01.18), 03.Sensing (R345.2)
AI_Vdc: 01.Connector (CN01.17 S_Vdc.1), 03.Sensing (R335.2)
BRK+: 01.Connector (BRK+.1 F141.2), 04.MOSFET (C452.2 D451.2 D453.2)
BRK-: 01.Connector (BRK.2 BRK-.1), 03.Sensing (U321.1 U321.2)
BRKOut: 03.Sensing (U321.3 U321.4), 04.MOSFET (5 pins)
IU: 01.Connector (CN01.8 IU.1), 03.Sensing (U301.8)
IV: 01.Connector (CN01.10 IV.1), 03.Sensing (U302.8)
IW: 01.Connector (CN01.12 IW.1), 03.Sensing (U303.8)
MOT_U: 01.Connector (MOT.1), 03.Sensing (R351.1 RSU.1)
MOT_V: 01.Connector (MOT.2), 03.Sensing (R353.1 RSV.1)
MOT_W: 01.Connector (MOT.3), 03.Sensing (R355.1 RSW.1)
PH_U: 03.Sensing (R352.1 RSU.2), 04.MOSFET (10 pins)
PH_V: 03.Sensing (R354.1 RSV.2), 04.MOSFET (10 pins)
PH_W: 03.Sensing (R356.1 RSW.2), 04.MOSFET (10 pins)
PWM_BRK: 01.Connector (CN01.15), 04.MOSFET (U451.1)
PWM_EN: 01.Connector (CN01.1), 04.MOSFET (R411.1 U401.10)
PWM_UN: 01.Connector (CN01.13), 04.MOSFET (R413.2 U401.7 UN.1)
PWM_UP: 01.Connector (CN01.11), 04.MOSFET (R412.2 U401.4 UP.1)
PWM_VN: 01.Connector (CN01.9), 04.MOSFET (R415.2 U401.6 VN.1)
PWM_VP: 01.Connector (CN01.7), 04.MOSFET (R414.2 U401.3 VP.1)
PWM_WN: 01.Connector (CN01.5), 04.MOSFET (R417.1 U401.5 WN.1)
PWM_WP: 01.Connector (CN01.3), 04.MOSFET (R416.1 U401.2 WP.1)